# EAGLE design Mixer-Analog-LM3900-Rev-A (EAGLE 8.4.3)
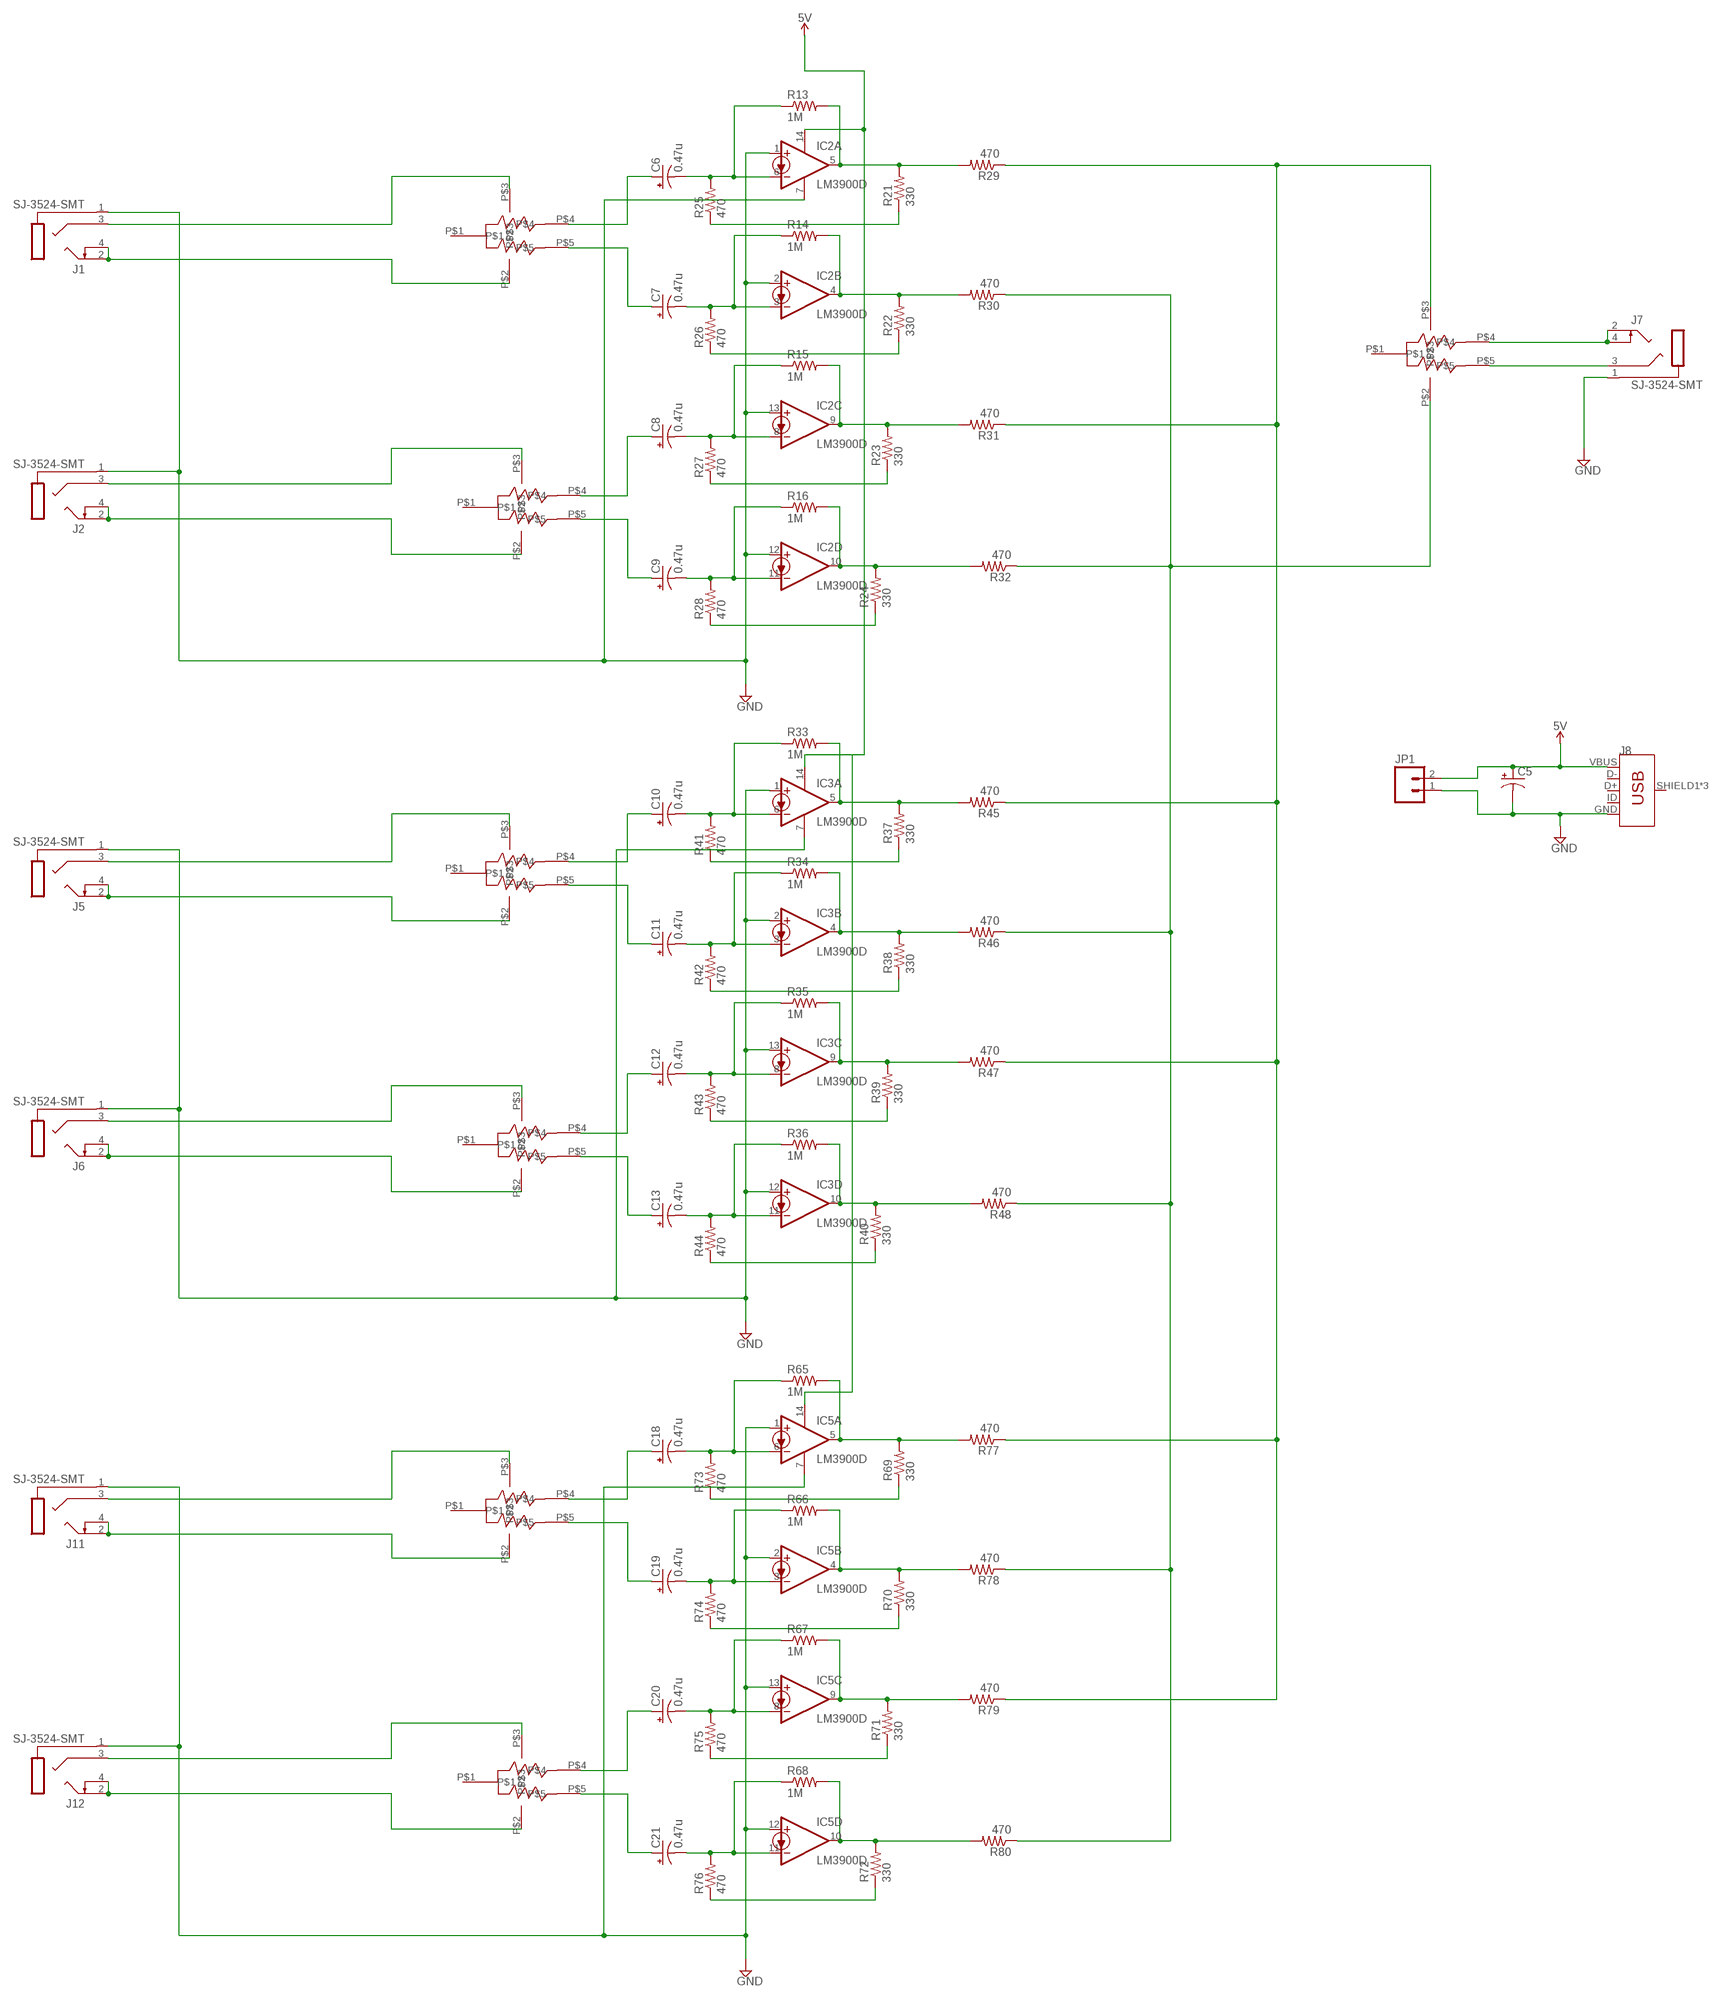
[diagram p0: schematic, sheet 1]

## Parts
C5  CAP_POLPTH1  [CPOL-RADIAL-100UF-25V]
C6  0.47u  CAP_POL1206-KIT  [EIA3216-KIT]
C7  0.47u  CAP_POL1206-KIT  [EIA3216-KIT]
C8  0.47u  CAP_POL1206-KIT  [EIA3216-KIT]
C9  0.47u  CAP_POL1206-KIT  [EIA3216-KIT]
C10  0.47u  CAP_POL1206-KIT  [EIA3216-KIT]
C11  0.47u  CAP_POL1206-KIT  [EIA3216-KIT]
C12  0.47u  CAP_POL1206-KIT  [EIA3216-KIT]
C13  0.47u  CAP_POL1206-KIT  [EIA3216-KIT]
C18  0.47u  CAP_POL1206-KIT  [EIA3216-KIT]
C19  0.47u  CAP_POL1206-KIT  [EIA3216-KIT]
C20  0.47u  CAP_POL1206-KIT  [EIA3216-KIT]
C21  0.47u  CAP_POL1206-KIT  [EIA3216-KIT]
IC2  LM3900D  [SO14]
IC3  LM3900D  [SO14]
IC5  LM3900D  [SO14]
J1  SJ-3524-SMT  [SJ-3524-SMT]
J2  SJ-3524-SMT  [SJ-3524-SMT]
J5  SJ-3524-SMT  [SJ-3524-SMT]
J6  SJ-3524-SMT  [SJ-3524-SMT]
J7  SJ-3524-SMT  [SJ-3524-SMT]
J8  USB_MICRO-B_FEMALE-SMT  [USB-B-MICRO-SMD]
J11  SJ-3524-SMT  [SJ-3524-SMT]
J12  SJ-3524-SMT  [SJ-3524-SMT]
JP1  M02LOCK  [1X02_LOCK]
R13  1M  RESISTOR1206  [1206]
R14  1M  RESISTOR1206  [1206]
R15  1M  RESISTOR1206  [1206]
R16  1M  RESISTOR1206  [1206]
R21  330  RESISTOR1206  [1206]
R22  330  RESISTOR1206  [1206]
R23  330  RESISTOR1206  [1206]
R24  330  RESISTOR1206  [1206]
R25  470  RESISTOR1206  [1206]
R26  470  RESISTOR1206  [1206]
R27  470  RESISTOR1206  [1206]
R28  470  RESISTOR1206  [1206]
R29  470  RESISTOR1206  [1206]
R30  470  RESISTOR1206  [1206]
R31  470  RESISTOR1206  [1206]
R32  470  RESISTOR1206  [1206]
R33  1M  RESISTOR1206  [1206]
R34  1M  RESISTOR1206  [1206]
R35  1M  RESISTOR1206  [1206]
R36  1M  RESISTOR1206  [1206]
R37  330  RESISTOR1206  [1206]
R38  330  RESISTOR1206  [1206]
R39  330  RESISTOR1206  [1206]
R40  330  RESISTOR1206  [1206]
R41  470  RESISTOR1206  [1206]
R42  470  RESISTOR1206  [1206]
R43  470  RESISTOR1206  [1206]
R44  470  RESISTOR1206  [1206]
R45  470  RESISTOR1206  [1206]
R46  470  RESISTOR1206  [1206]
R47  470  RESISTOR1206  [1206]
R48  470  RESISTOR1206  [1206]
R65  1M  RESISTOR1206  [1206]
R66  1M  RESISTOR1206  [1206]
R67  1M  RESISTOR1206  [1206]
R68  1M  RESISTOR1206  [1206]
R69  330  RESISTOR1206  [1206]
R70  330  RESISTOR1206  [1206]
R71  330  RESISTOR1206  [1206]
R72  330  RESISTOR1206  [1206]
R73  470  RESISTOR1206  [1206]
R74  470  RESISTOR1206  [1206]
R75  470  RESISTOR1206  [1206]
R76  470  RESISTOR1206  [1206]
R77  470  RESISTOR1206  [1206]
R78  470  RESISTOR1206  [1206]
R79  470  RESISTOR1206  [1206]
R80  470  RESISTOR1206  [1206]
U$3  POT-DUAL-ALPS-RK10J12E0A0A  [POT-DUAL-ALPS-RK10J12E0A0A]
U$4  POT-DUAL-ALPS-RK10J12E0A0A  [POT-DUAL-ALPS-RK10J12E0A0A]
U$5  POT-DUAL-ALPS-RK10J12E0A0A  [POT-DUAL-ALPS-RK10J12E0A0A]
U$6  POT-DUAL-ALPS-RK10J12E0A0A  [POT-DUAL-ALPS-RK10J12E0A0A]
U$7  POT-DUAL-ALPS-RK10J12E0A0A  [POT-DUAL-ALPS-RK10J12E0A0A]
U$10  POT-DUAL-ALPS-RK10J12E0A0A  [POT-DUAL-ALPS-RK10J12E0A0A]
U$11  POT-DUAL-ALPS-RK10J12E0A0A  [POT-DUAL-ALPS-RK10J12E0A0A]

## Nets
5V: C5.1(+) IC2.14(P:V+) IC3.14(P:V+) IC5.14(P:V+) J8.VBUS JP1.2
GND: C5.2(-) IC2.1(A:+IN) IC2.2(B:+IN) IC2.7(P:GND) IC2.12(D:+IN) IC2.13(C:+IN) IC3.1(A:+IN) IC3.2(B:+IN) IC3.7(P:GND) IC3.12(D:+IN) IC3.13(C:+IN) IC5.1(A:+IN) IC5.2(B:+IN) IC5.7(P:GND) IC5.12(D:+IN) IC5.13(C:+IN) J1.1(S) J2.1(S) J5.1(S) J6.1(S) J7.1(S) J8.GND J11.1(S) J12.1(S) JP1.1
N$18: IC2.5(A:OUT) R13.2 R21.2 R29.2
N$21: C6.C(-) IC2.6(A:-IN) R13.1 R25.2
N$23: R21.1 R25.1
N$24: IC2.4(B:OUT) R14.2 R22.2 R30.2
N$25: C7.C(-) IC2.3(B:-IN) R14.1 R26.2
N$26: R22.1 R26.1
N$27: IC2.9(C:OUT) R15.2 R23.2 R31.2
N$28: C8.C(-) IC2.8(C:-IN) R15.1 R27.2
N$29: R23.1 R27.1
N$30: IC2.10(D:OUT) R16.2 R24.2 R32.2
N$31: C9.C(-) IC2.11(D:-IN) R16.1 R28.2
N$32: R24.1 R28.1
N$33: C9.A(+) U$3.P$5
N$34: C8.A(+) U$3.P$4
N$35: C7.A(+) U$4.P$5
N$36: C6.A(+) U$4.P$4
N$37: J1.2(T) J1.4(TS) U$4.P$2
N$38: J2.2(T) J2.4(TS) U$3.P$2
N$39: J2.3(R) U$3.P$3
N$40: J1.3(R) U$4.P$3
N$43: IC3.5(A:OUT) R33.2 R37.2 R45.2
N$44: C10.C(-) IC3.6(A:-IN) R33.1 R41.2
N$45: R37.1 R41.1
N$46: IC3.4(B:OUT) R34.2 R38.2 R46.2
N$47: C11.C(-) IC3.3(B:-IN) R34.1 R42.2
N$48: R38.1 R42.1
N$49: IC3.9(C:OUT) R35.2 R39.2 R47.2
N$50: C12.C(-) IC3.8(C:-IN) R35.1 R43.2
N$51: R39.1 R43.1
N$52: IC3.10(D:OUT) R36.2 R40.2 R48.2
N$53: C13.C(-) IC3.11(D:-IN) R36.1 R44.2
N$54: R40.1 R44.1
N$55: C13.A(+) U$5.P$5
N$56: C12.A(+) U$5.P$4
N$57: C11.A(+) U$6.P$5
N$58: C10.A(+) U$6.P$4
N$59: J5.2(T) J5.4(TS) U$6.P$2
N$60: J6.2(T) J6.4(TS) U$5.P$2
N$61: J7.2(T) J7.4(TS) U$7.P$4
N$62: J7.3(R) U$7.P$5
N$64: J6.3(R) U$5.P$3
N$66: J5.3(R) U$6.P$3
N$91: IC5.5(A:OUT) R65.2 R69.2 R77.2
N$92: C18.C(-) IC5.6(A:-IN) R65.1 R73.2
N$93: R69.1 R73.1
N$94: IC5.4(B:OUT) R66.2 R70.2 R78.2
N$95: C19.C(-) IC5.3(B:-IN) R66.1 R74.2
N$96: R70.1 R74.1
N$97: IC5.9(C:OUT) R67.2 R71.2 R79.2
N$98: C20.C(-) IC5.8(C:-IN) R67.1 R75.2
N$99: R71.1 R75.1
N$100: IC5.10(D:OUT) R68.2 R72.2 R80.2
N$101: C21.C(-) IC5.11(D:-IN) R68.1 R76.2
N$102: R72.1 R76.1
N$103: C21.A(+) U$10.P$5
N$104: C20.A(+) U$10.P$4
N$105: C19.A(+) U$11.P$5
N$106: C18.A(+) U$11.P$4
N$107: J11.2(T) J11.4(TS) U$11.P$2
N$108: J12.2(T) J12.4(TS) U$10.P$2
N$109: J12.3(R) U$10.P$3
N$110: J11.3(R) U$11.P$3
N$111: R29.1 R31.1 R45.1 R47.1 R77.1 R79.1 U$7.P$3
N$112: R30.1 R32.1 R46.1 R48.1 R78.1 R80.1 U$7.P$2
Unconnected: J8.D+ J8.D- J8.ID J8.SHIELD1(SHIELD) J8.SHIELD2(SHIELD) J8.SHIELD3(SHIELD) U$3.P$1 U$4.P$1 U$5.P$1 U$6.P$1 U$7.P$1 U$10.P$1 U$11.P$1

## Library data of the parts
C5-C13 C18-C21 = SparkFun-Passives:CAP_POL: Capacitor Polarized These are standard SMD and PTH capacitors. Normally 10uF, 47uF, and 100uF in electrolytic and tantalum varieties. Always verify the external diameter of the through hole cap, it varies with capacity, voltage, and manufacturer. The EIA devices should be standard.
IC2 IC3 IC5 = linear:LM3900: OP AMP
J1 J2 J5-J7 J11 J12 = con-cuistack:SJ-3524: 3.5 Stereo audio jack (SMT)
J8 = SparkFun-Connectors:USB_MICRO-B: USB Type Micro-B Connector Male/female and PTH/SMT variants SparkFun Products: SparkFun microB USB Breakout <https://www.sparkfun.com/products/12035> SparkFun USB microB Plug Breakout <https://www.sparkfun.com/products/10031> SparkFun ESP8266 Thing <https://www.sparkfun.com/products/13231>; PROD_ID: CONN-11752
JP1 = CMU-ArtFab:M02: Header 2 Standard 2-pin 0.1" header. Use with straight break away headers (SKU : PRT-00116), right angle break away headers (PRT-00553), swiss pins (PRT-00743), machine pins (PRT-00117), and female headers (PRT-00115). Molex polarized connector foot print use with SKU : PRT-08233 with associated crimp pins and housings.
R13-R16 R21-R48 R65-R80 = SparkFun-Passives:RESISTOR: Resistor Basic schematic elements and footprints for 0603, 1206, and PTH resistors.
U$3-U$7 U$10 U$11 = CMU-ArtFab:POT-DUAL-ALPS-RK10J12E0A0A

## Board
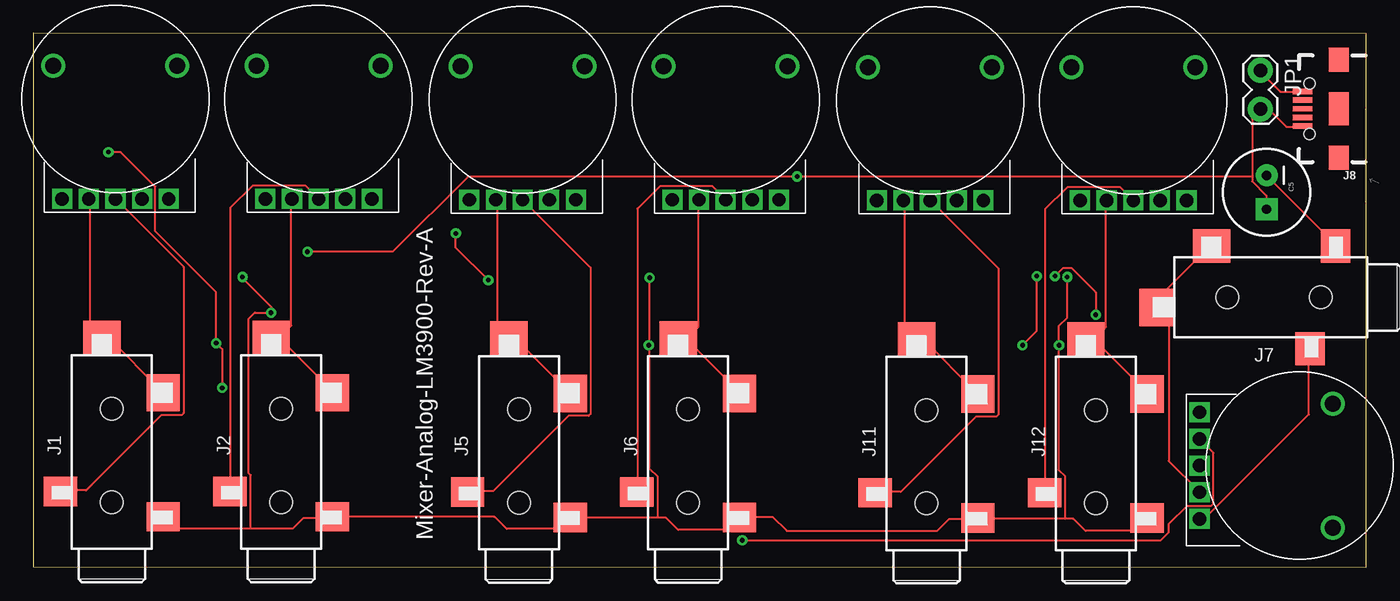
[diagram p1: board, top side]
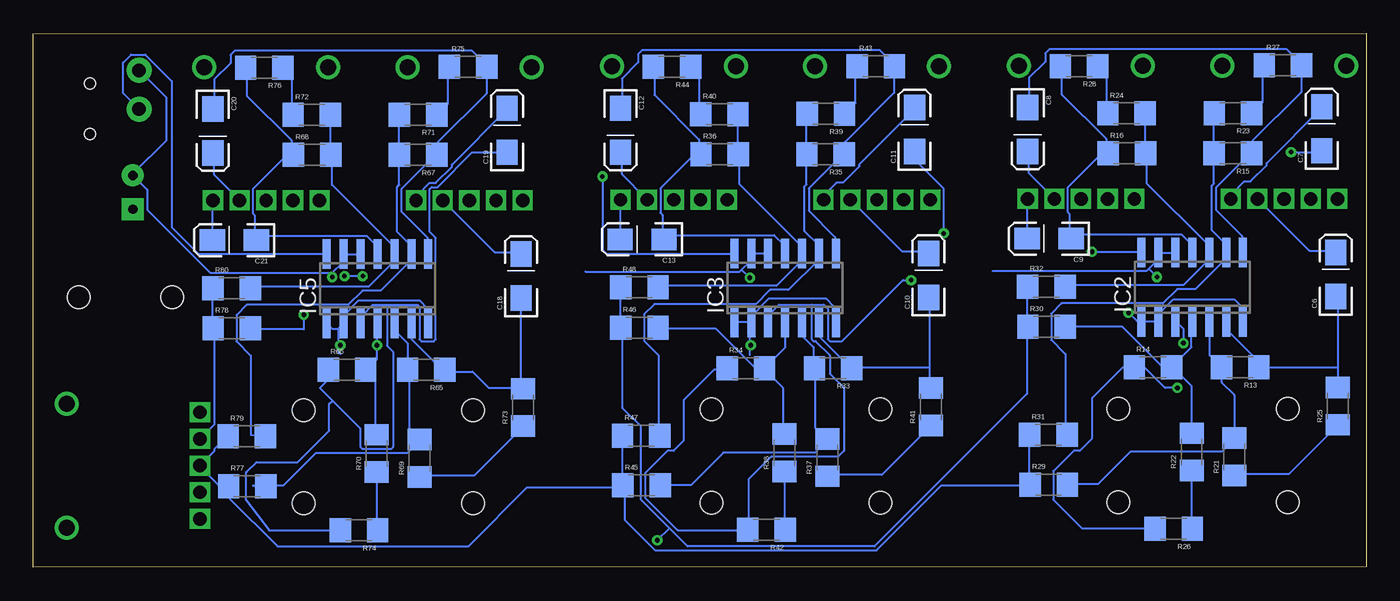
[diagram p2: board, bottom side, seen from below]

Size 100 x 40.05 mm. Coordinates in mm from the lower left corner, seen from the top.
Outline: 0,0.05 100,0 100,40 0,40.05 0,0.05
Copper layers (1*16): Top 0.035mm / dielectric 1.5mm / Bottom 0.035mm
Design rules "default": minimum track width 6mil, minimum drill 0.35mm, track to track 6mil, track to pad 6mil, pad to pad 6mil, via to via 6mil, smd to smd 6mil, copper to edge 40mil, drill to drill 6mil, minimum pad ring 10mil, minimum via ring 8mil, stop-mask expansion 4mil, vias tented up to drill 0mil, thermal gap 10mil

### Footprints (pad centres in the part's own frame; a part is rotated, then mirrored left to right if it is on the bottom)
CPOL-RADIAL-100UF-25V = drill 0.7 pad 1.651 square: 1 1.27,0 | drill 0.7 pad 1.651: 2 -1.27,0
EIA3216-KIT = smd 1.9 x 1.6: A 1.65,0; C -1.65,0
SO14 = smd 0.6 x 2.2: 1 -3.81,-2.6; 2 -2.54,-2.6; 3 -1.27,-2.6; 4 0,-2.6; 5 1.27,-2.6; 6 2.54,-2.6; 7 3.81,-2.6; 8 3.81,2.6; 9 2.54,2.6; 10 1.27,2.6; 11 0,2.6; 12 -1.27,2.6; 13 -2.54,2.6; 14 -3.81,2.6
SJ-3524-SMT = smd 2.5 x 2.2: 1 3.85,-4.6; 3 -3.85,-2.7 | smd 2.5 x 2.8: 2 3.85,4.7 | smd 2.8 x 2.5: 4 -0.75,8.85 | hole 1.7: 0,-3.5; 0,3.5
USB-B-MICRO-SMD = smd 1.45 x 0.4: D+ 2.725,0; D- 2.725,0.65; GND 2.725,-1.3; ID 2.725,-0.65; VBUS 2.725,1.3 | smd 1.5 x 1.8: SHIELD1 0,3.685; SHIELD2 0,-3.685 | smd 1.5 x 2.5: SHIELD3 0,0 | hole 0.85: 2.2,1.9; 2.2,-1.9
1X02_LOCK = drill 1.016 pad 1.88: 1 -0.178,0; 2 2.718,0
1206 = smd 1.6 x 1.8: 1 -1.4,0; 2 1.4,0
POT-DUAL-ALPS-RK10J12E0A0A = drill 1 pad 1.321 square: P$1 -4,0; P$2 -2,0; P$3 0,0; P$4 2,0; P$5 4,0 | drill 1.2: P$6 4.65,10; P$7 -4.65,10

### Placement (x,y rotation side)
C5  92.53,28.13 270 top
C6  2.28,21.96 90 bottom
C7  3.33,32.89 90 bottom
C8  25.4,32.84 270 bottom
C9  23.79,24.66 180 bottom
C10  32.83,21.9 90 bottom
C11  33.88,32.83 90 bottom
C12  55.95,32.78 270 bottom
C13  54.34,24.6 180 bottom
C18  63.41,21.85 90 bottom
C19  64.46,32.78 90 bottom
C20  86.53,32.73 270 bottom
C21  84.92,24.55 180 bottom
IC2  13.05,21.01 0 bottom
IC3  43.6,20.95 0 bottom
IC5  74.18,20.9 0 bottom
J1  5.89,8.4 0 top
J2  18.59,8.4 0 top
J5  36.44,8.34 0 top
J6  49.14,8.34 0 top
J7  93.09,20.25 90 top
J8  97.96,34.39 180 top
J11  67.02,8.29 0 top
J12  79.72,8.29 0 top
JP1  92.06,37.09 270 top
R13  9.45,15 180 bottom
R14  16,15 0 bottom
R15  10.01,31.04 180 bottom
R16  17.96,31.04 0 bottom
R21  9.89,8.29 90 bottom
R22  13.1,8.65 90 bottom
R23  10,34.07 180 bottom
R24  17.98,34.04 0 bottom
R25  2.12,12.1 90 bottom
R26  14.45,2.89 180 bottom
R27  6.25,37.64 0 bottom
R28  21.54,37.59 180 bottom
R29  23.82,6.2 0 bottom
R30  23.98,18.04 0 bottom
R31  23.85,9.94 0 bottom
R32  23.99,21.06 0 bottom
R33  40,14.94 180 bottom
R34  46.55,14.94 0 bottom
R35  40.56,30.98 180 bottom
R36  48.51,30.98 0 bottom
R37  40.43,8.23 90 bottom
R38  43.65,8.59 90 bottom
R39  40.55,34.01 180 bottom
R40  48.53,33.98 0 bottom
R41  32.67,12.04 90 bottom
R42  44.99,2.83 180 bottom
R43  36.8,37.58 0 bottom
R44  52.09,37.53 180 bottom
R45  54.37,6.14 0 bottom
R46  54.53,17.98 0 bottom
R47  54.4,9.87 0 bottom
R48  54.54,21 0 bottom
R65  70.52,14.81 180 bottom
R66  76.47,14.83 0 bottom
R67  71.14,30.93 180 bottom
R68  79.09,30.93 0 bottom
R69  71.01,8.18 90 bottom
R70  74.23,8.54 90 bottom
R71  71.13,33.96 180 bottom
R72  79.11,33.93 0 bottom
R73  63.25,11.99 90 bottom
R74  75.57,2.78 180 bottom
R75  67.38,37.53 0 bottom
R76  82.67,37.48 180 bottom
R77  83.95,6.09 0 bottom
R78  85.11,17.93 0 bottom
R79  83.98,9.82 0 bottom
R80  85.12,20.95 0 bottom
U$3  21.4,27.63 0 top
U$4  6.16,27.63 0 top
U$5  51.95,27.57 0 top
U$6  36.71,27.57 0 top
U$7  87.5,7.63 270 top
U$10  82.53,27.52 0 top
U$11  67.29,27.52 0 top

### Tracks (layer width: path | path; a pad name or v marks a point on that pad's centre or on a via)
5V  (via drill 0.35)
  Top 0.152: 91.44,29.31 91.44,33.66 92.05,34.27 JP1.2 92.68,34.37 94,33.05 95.19,33.05 J8.VBUS | 91.44,29.31 91.44,28.94 92.51,27.87 92.51,26.96 C5.1 | v20.57,23.67 26.98,23.67 32.61,29.31 v57.3,29.31 91.44,29.31
  Bottom 0.152: v20.57,23.67 16.92,23.67 IC2.14 | v57.3,29.31 57.3,23.82 57,23.52 47.55,23.52 IC3.14 | IC5.14 78.03,23.52 87.63,23.52 89.61,25.5 89.61,36.47 91.59,38.45 92.66,38.45 93.27,37.84 93.27,35.56 92.2,34.49 JP1.2
GND  (via drill 0.35)
  Top 0.152: 46.85,3.73 47.46,3.73 48.38,2.82 52.03,2.82 52.95,3.73 J6.1 53.03,3.79 55.47,3.79 56.54,2.73 67.82,2.73 68.73,3.64 70.71,3.64 J11.1 70.87,3.64 77.42,3.64 | 46.85,3.73 J5.1 40.23,3.64 39.47,2.88 35.51,2.88 34.59,3.79 22.55,3.79 J2.1 22.4,3.71 20.27,3.71 19.51,2.95 16.31,2.95 | 46.24,16.66 46.24,7.39 46.85,6.78 46.85,3.73 | 46.24,16.66 v46.24,21.71 | J7.1 97.69,24.21 92.51,29.4 C5.2 | 77.42,3.64 78.03,3.64 78.94,2.73 82.6,2.73 83.52,3.64 J12.1 | 77.42,3.64 77.42,6.84 76.96,7.3 v76.96,16.66 76.96,18.12 77.57,18.73 v77.57,21.78 | v15.7,21.78 15.7,21.69 17.83,19.56 v17.83,19.1 16.61,19.1 16.15,18.64 16.15,7.06 16.31,6.91 16.31,2.95 | 16.31,2.95 10.52,2.95 9.75,3.71 J1.1 | v46.18,16.66 46.24,16.66 | JP1.1 92.06,37.18 93.56,35.68 J8.GND
  Bottom 0.152: IC2.7 9.3,18.42 9.3,19.49 9.91,20.1 14.48,20.1 15.54,19.03 15.54,18.42 IC2.2 15.7,18.42 16.76,18.42 IC2.1 16.92,18.49 17.22,18.49 v17.83,19.1 | IC2.12 15.54,23.61 IC2.13 15.7,23.61 15.7,23 16.31,22.39 | 16.31,22.39 16.46,22.23 28.04,22.23 | 16.31,22.39 v15.7,21.78 | IC3.1 47.31,18.36 46.24,18.36 IC3.2 | 46.24,15.92 46.24,16.66 | 46.24,16.66 46.24,18.21 IC3.2 | IC3.12 46.09,23.54 IC3.13 46.24,23.54 46.24,22.94 46.85,22.32 | 46.85,22.32 47.01,22.17 58.59,22.17 | 46.85,22.32 v46.24,21.71 | 77.89,18.31 IC5.1 77.88,18.19 77.57,17.88 77.11,17.88 | 76.82,18.31 IC5.2 | IC5.12 76.67,23.49 IC5.13 76.81,23.45 76.81,22.84 77.57,22.08 | 77.57,22.08 86.72,22.08 91.44,26.81 91.44,28.33 92.51,29.4 C5.2 92.53,29.52 90,32.05 90,35.21 JP1.1 | 76.96,15.99 77.11,16.14 77.11,16.66 | v77.57,21.78 77.57,22.08 | IC3.7 39.93,18.49 39.93,19.56 40.54,20.17 44.81,20.17 46.02,18.95 46.02,18.49 IC3.2 | IC5.7 70.41,18.34 70.41,19.41 71.02,20.01 75.59,20.01 76.66,18.95 76.66,18.34 IC5.2 | 77.11,17.88 77.11,16.66 | 77.11,17.88 76.81,18.19 IC5.2 | v76.96,16.66 77.11,16.66 | v46.18,16.66 46.24,16.66
N$18
  Bottom 0.152: R29.2 22.4,6.23 20.12,6.23 17.68,8.67 10.82,8.67 9.91,9.58 R21.2 9.91,9.74 9.91,12.94 10.82,13.85 R13.2 10.97,15.14 11.73,15.9 11.73,18.34 IC2.5
N$21
  Bottom 0.152: IC2.6 10.36,18.34 10.36,17.73 8.08,15.44 8.08,15.14 R13.1 7.92,14.99 2.13,14.99 | 2.13,14.99 2.13,20.17 C6.C | 2.13,14.99 2.13,13.61 R25.2
N$23
  Bottom 0.152: R21.1 9.75,6.99 5.79,6.99 2.13,10.65 R25.1
N$24
  Bottom 0.152: R22.2 13.11,10.11 13.11,13.61 14.48,14.99 R14.2 | R30.2 22.55,18.03 18.29,18.03 15.39,15.14 14.63,15.14 R14.2 | IC2.4 13.11,18.34 13.11,16.51 14.48,15.14 R14.2
N$25  (via drill 0.35)
  Top 0.152: v5.64,31.14 6.55,31.14 9.14,28.55 9.14,25.2 13.72,20.62 v13.72,16.81 14.17,16.36 v14.17,13.46
  Bottom 0.152: R26.2 15.85,2.95 21.34,2.95 23.47,5.08 23.47,7.21 21.95,8.74 21.49,8.74 20.57,9.65 20.57,12.7 18.29,14.99 17.53,14.99 R14.1 17.37,14.99 16.61,14.99 15.09,13.46 v14.17,13.46 | v5.64,31.14 3.35,31.14 C7.C | v13.72,16.81 13.72,17.88 14.17,18.34 IC2.3
N$26
  Bottom 0.152: R26.1 13.11,3.03 13.11,7.15 R22.1
N$27
  Bottom 0.152: R23.2 11.43,33.97 11.43,31.07 R15.2 11.43,30.92 11.43,28.79 11.58,28.63 11.58,25.28 10.52,24.21 10.52,23.76 IC2.9 10.52,23.15 12.8,20.86 14.17,20.86 15.24,19.8 22.86,19.8 23.62,19.03 23.62,17.05 22.55,15.99 22.55,10.04 R31.2
N$28
  Bottom 0.152: C8.C 25.3,34.58 25.3,36.71 24.08,37.93 24.08,38.54 23.77,38.84 5.94,38.84 4.88,37.78 R27.2 4.88,37.63 4.88,35.64 8.53,31.99 8.53,31.07 R15.1 8.69,31.07 11.28,28.48 11.28,26.81 9.3,24.82 9.3,23.76 IC2.8
N$29
  Bottom 0.152: R27.1 7.77,37.63 7.77,34.88 8.53,34.12 R23.1
N$30
  Bottom 0.152: R24.2 16.61,33.97 16.61,31.07 R16.2 16.46,30.92 16.46,28.79 11.89,24.21 11.89,23.76 IC2.10 11.89,23.61 11.89,23 13.72,21.17 22.55,21.17 R32.2
N$31
  Bottom 0.152: R28.2 22.86,37.47 22.86,35.49 19.51,32.14 19.51,31.07 R16.1 19.51,30.92 19.96,30.92 22.4,28.48 22.4,26.65 22.25,26.5 22.25,24.98 | 22.25,24.98 22.25,24.67 C9.C 22.25,24.98 | 22.25,24.98 13.87,24.98 13.11,24.21 13.11,23.76 IC2.11
N$32
  Bottom 0.152: R24.1 19.51,34.12 19.51,36.86 20.12,37.47 R28.1
N$33
  Bottom 0.152: C9.A 25.45,24.67 25.45,27.57 U$3.P$5
N$34
  Bottom 0.152: C8.A 25.3,31.07 25.3,29.55 23.47,27.72 U$3.P$4
N$35
  Bottom 0.152: C7.A 3.35,34.43 7.47,30.31 7.47,30.16 8.69,28.94 9.14,28.94 10.06,28.03 10.06,27.72 U$4.P$5
N$36
  Bottom 0.152: C6.A 2.29,23.76 4.27,23.76 8.08,27.57 U$4.P$4
N$37
  Top 0.152: J1.2 9.6,13.24 5.64,17.2 5.18,17.2 J1.4 5.03,17.36 4.27,18.12 4.27,27.57 U$4.P$2
N$38
  Top 0.152: 18.44,17.2 17.98,17.2 J2.4 18.44,17.2 | 18.44,17.2 22.4,13.24 J2.2 | 18.44,17.2 19.36,18.12 19.36,27.57 U$3.P$2
N$39
  Top 0.152: J2.3 14.78,5.77 14.78,26.96 16.46,28.63 20.42,28.63 21.34,27.72 U$3.P$3
N$40
  Top 0.152: J1.3 2.13,5.77 3.96,5.77 9.6,11.41 11.12,11.41 11.28,11.57 11.28,22.54 6.25,27.57 U$4.P$3
N$43
  Bottom 0.152: R45.2 52.95,6.17 50.66,6.17 48.22,8.61 41.37,8.61 40.45,9.52 R37.2 40.54,9.65 41.3,10.41 41.3,14.83 R33.2 41.45,14.99 41.45,16.51 42.22,17.27 42.22,18.34 IC3.5
N$44
  Bottom 0.152: IC3.6 41,18.34 41,17.27 38.71,14.99 R33.1 38.56,14.99 32.77,14.99 | 32.77,14.99 32.77,20.17 C10.C | 32.77,14.99 32.77,13.46 R41.2
N$45
  Bottom 0.152: R37.1 40.3,6.93 36.34,6.93 32.68,10.59 R41.1
N$46
  Bottom 0.152: 43.65,17.6 43.65,18.21 IC3.4 43.59,17.58 43.59,16.51 45.11,14.99 R34.2 | R38.2 43.74,10.11 43.74,13.46 45.11,14.83 R34.2 | R46.2 53.03,17.88 48.77,17.88 45.87,14.99 45.26,14.99 R34.2
N$47  (via drill 0.35)
  Top 0.152: v31.7,25.04 31.7,23.98 v34.14,21.54
  Bottom 0.152: R34.1 48.01,14.83 48.92,14.83 51.21,12.55 51.21,9.5 51.97,8.74 52.43,8.74 54.1,7.06 54.1,5.23 51.66,2.79 46.48,2.79 R42.2 46.33,2.95 46.33,6.6 44.65,8.28 39.62,8.28 39.17,8.74 39.17,13.46 40.23,14.53 40.23,15.9 41.3,16.97 41.45,16.97 41.6,17.12 41.6,19.71 | v31.7,25.04 31.7,28.4 33.83,30.53 33.83,31.14 C11.C | v34.14,21.54 34.75,21.54 39.32,16.97 40.23,16.97 40.39,17.12 40.39,19.41 40.69,19.71 41.6,19.71 | 41.6,19.71 44.04,19.71 44.81,18.95 44.81,18.49 IC3.3
N$48
  Bottom 0.152: R42.1 43.65,2.97 43.65,7.08 R38.1
N$49
  Bottom 0.152: R39.2 41.98,33.91 41.98,31.01 R35.2 41.98,30.86 41.98,28.73 42.13,28.57 42.13,25.22 41.06,24.15 41.06,23.7 IC3.9 41.06,23.09 43.35,20.8 44.72,20.8 45.79,19.73 53.41,19.73 54.17,18.97 54.17,16.99 53.1,15.92 53.1,9.98 R47.2
N$50
  Bottom 0.152: C12.C 55.84,34.52 55.84,36.65 54.62,37.87 54.62,38.48 54.32,38.78 36.49,38.78 35.42,37.72 R43.2 35.42,37.56 35.42,35.58 39.08,31.93 39.08,31.01 R35.1 39.23,31.01 41.82,28.42 41.82,26.75 39.84,24.76 39.84,23.7 IC3.8
N$51
  Bottom 0.152: R43.1 38.32,37.56 38.32,34.82 39.08,34.06 R39.1
N$52
  Bottom 0.152: R40.2 47.16,33.91 47.16,31.01 R36.2 47.01,30.86 47.01,28.73 42.43,24.15 42.43,23.7 IC3.10 42.43,23.54 42.43,22.94 44.26,21.11 53.1,21.11 R48.2
N$53
  Bottom 0.152: R44.2 53.41,37.41 53.41,35.43 50.05,32.08 50.05,31.01 R36.1 50.05,30.86 50.51,30.86 52.95,28.42 52.95,26.59 52.8,26.44 52.8,24.92 | 52.8,24.92 52.8,24.61 C13.C 52.8,24.92 | 52.8,24.92 44.41,24.92 43.65,24.15 43.65,23.7 IC3.11
N$54
  Bottom 0.152: R40.1 50.05,34.06 50.05,36.8 50.66,37.41 R44.1
N$55
  Bottom 0.152: C13.A 56,27.51 U$5.P$5
N$56
  Bottom 0.152: C12.A 55.84,31.01 55.84,29.49 54.02,27.66 U$5.P$4
N$57
  Bottom 0.152: C11.A 33.9,34.36 38.01,30.25 38.01,30.1 39.23,28.88 39.69,28.88 40.6,27.96 40.6,27.66 U$6.P$5
N$58
  Bottom 0.152: C10.A 32.83,23.7 34.81,23.7 38.62,27.51 U$6.P$4
N$59
  Top 0.152: J5.2 40.15,13.18 36.18,17.14 35.73,17.14 J5.4 35.58,17.3 34.81,18.06 34.81,27.51 U$6.P$2
N$60
  Top 0.152: 48.99,17.14 48.53,17.14 J6.4 48.99,17.14 | 48.99,17.14 52.95,13.18 J6.2 | 48.99,17.14 49.9,18.06 49.9,27.51 U$5.P$2
N$61
  Top 0.152: J7.2 88.24,24.06 84.28,20.1 84.28,19.64 J7.4 84.28,19.41 85.19,18.49 85.19,7.97 87.48,5.69 U$7.P$4
N$62
  Top 0.152: J7.3 95.71,16.36 95.71,11.48 87.94,3.71 87.63,3.71 U$7.P$5
N$64
  Top 0.152: J6.3 45.33,5.71 45.33,26.9 47.01,28.57 50.97,28.57 51.88,27.66 U$5.P$3
N$66
  Top 0.152: J5.3 32.68,5.71 34.51,5.71 40.15,11.35 41.67,11.35 41.82,11.51 41.82,22.48 36.79,27.51 U$6.P$3
N$91
  Bottom 0.152: R77.2 83.53,6.12 81.24,6.12 78.8,8.56 71.95,8.56 71.03,9.47 R69.2 71.02,9.65 71.78,10.41 71.78,14.68 R65.2 71.93,14.83 71.93,16.81 72.85,17.73 72.85,18.19 IC5.5
N$92
  Bottom 0.152: 63.4,13.46 65.84,13.46 67.06,14.68 69.04,14.68 R65.1 69.19,14.68 71.63,17.12 71.63,18.19 IC5.6 | 63.4,13.46 63.25,13.46 R73.2 63.4,13.46 | 63.4,13.46 63.4,20.17 C18.C
N$93
  Bottom 0.152: R69.1 70.88,6.88 66.92,6.88 63.26,10.54 R73.1
N$94  (via drill 0.35)
  Top 0.152: v79.7,18.95 79.7,20.62 77.88,22.45 77.27,22.45 v76.66,21.84 | v75.29,21.84 75.29,17.73 v74.22,16.66
  Bottom 0.152: R78.2 83.68,17.86 79.72,17.86 79.7,17.88 v79.7,18.95 | 74.23,17.55 74.23,18.16 IC5.4 74.22,17.58 v74.22,16.66 74.22,15.6 74.98,14.83 R66.2 74.98,14.68 74.37,14.07 74.37,9.96 R70.2 | v75.29,21.84 v76.66,21.84
N$95
  Bottom 0.152: R74.2 76.97,2.77 82.31,2.77 84.02,5.02 84.02,7.16 83.98,7.16 83.25,7.89 80.15,7.89 77.79,10.25 77.79,12.26 77.56,12.49 | 73.47,19.68 74.54,19.68 75.3,18.92 75.3,18.31 IC5.3 | 73.47,19.68 71.18,19.68 71.03,19.53 71.03,17.09 70.88,16.94 69.97,16.94 69.81,17.09 69.81,24.71 70.27,25.17 70.27,28.37 70.12,28.52 69.66,28.52 67.07,31.11 64.48,31.11 C19.C | 77.56,12.49 78.5,13.44 78.49,13.46 77.88,14.07 77.88,14.68 R66.1 | 77.56,12.49 75.45,10.39 75.45,9.02 75.3,8.86 73.17,8.86 73.01,9.02 73.01,16.18 73.47,16.64 73.47,19.68
N$96
  Bottom 0.152: R74.1 74.23,2.92 74.23,7.04 R70.1
N$97
  Bottom 0.152: R71.2 72.56,33.86 72.56,30.96 R67.2 72.56,30.81 72.56,28.68 72.71,28.52 72.71,25.17 71.64,24.1 71.64,23.65 IC5.9 71.64,23.04 73.93,20.75 75.3,20.75 76.37,19.68 83.99,19.68 84.75,18.92 84.75,16.94 83.68,15.87 83.68,9.93 R79.2
N$98
  Bottom 0.152: C20.C 86.42,34.47 86.42,36.6 85.2,37.82 85.2,38.43 84.9,38.73 67.07,38.73 66,37.67 R75.2 66,37.52 66,35.53 69.66,31.88 69.66,30.96 R67.1 69.81,30.96 72.4,28.37 72.4,26.7 70.42,24.71 70.42,23.65 IC5.8
N$99
  Bottom 0.152: R75.1 68.9,37.52 68.9,34.77 69.66,34.01 R71.1
N$100
  Bottom 0.152: R72.2 77.74,33.86 77.74,30.96 R68.2 77.58,30.81 77.58,28.68 73.01,24.1 73.01,23.65 IC5.10 73.01,23.49 73.01,22.89 74.84,21.06 83.68,21.06 R80.2
N$101
  Bottom 0.152: R76.2 83.99,37.36 83.99,35.38 80.63,32.03 80.63,30.96 R68.1 80.63,30.81 81.09,30.81 83.53,28.37 83.53,26.54 83.38,26.39 83.38,24.87 | 83.38,24.87 83.38,24.56 C21.C 83.38,24.87 | 83.38,24.87 74.99,24.87 74.23,24.1 74.23,23.65 IC5.11
N$102
  Bottom 0.152: R72.1 80.63,34.01 80.63,36.75 81.24,37.36 R76.1
N$103
  Bottom 0.152: C21.A 86.58,27.46 U$10.P$5
N$104
  Bottom 0.152: C20.A 86.42,30.96 86.42,29.44 84.59,27.61 U$10.P$4
N$105
  Bottom 0.152: C19.A 64.48,34.31 68.59,30.2 68.59,30.05 69.81,28.83 70.27,28.83 71.18,27.91 71.18,27.61 U$11.P$5
N$106
  Bottom 0.152: C18.A 63.41,23.65 65.39,23.65 69.2,27.46 U$11.P$4
N$107
  Top 0.152: J11.2 70.73,13.13 66.76,17.09 66.31,17.09 J11.4 66.16,17.25 65.39,18.01 65.39,27.46 U$11.P$2
N$108
  Top 0.152: 79.57,17.09 79.11,17.09 J12.4 79.57,17.09 | 79.57,17.09 83.53,13.13 J12.2 | 79.57,17.09 80.48,18.01 80.48,27.46 U$10.P$2
N$109
  Top 0.152: J12.3 75.91,5.66 75.91,26.85 77.58,28.52 81.55,28.52 82.46,27.61 U$10.P$3
N$110
  Top 0.152: J11.3 63.26,5.66 65.09,5.66 70.73,11.3 72.25,11.3 72.4,11.46 72.4,22.43 67.37,27.46 U$11.P$3
N$111
  Bottom 0.152: R31.1 25.3,9.89 25.3,6.23 R29.1 25.3,6.15 31.85,6.15 36.73,1.27 53.34,1.27 55.63,3.55 55.63,5.99 R45.1 | R45.1 55.84,6.17 55.84,9.83 R47.1 | R79.1 85.5,9.8 86.41,8.89 86.41,8.74 87.48,7.67 U$7.P$3 87.48,7.52 86.11,6.15 85.5,6.15 R77.1 85.34,5.99 85.34,5.23 81.69,1.57 67.36,1.57 62.94,5.99 55.78,5.99 R45.1
N$112  (via drill 0.35)
  Top 0.152: v53.19,2.03 84.58,2.03 85.19,2.64 85.19,3.25 86.56,4.62 88.39,4.62 88.54,4.77 88.54,8.58 87.63,9.5 U$7.P$2
  Bottom 0.152: R78.1 86.58,18.01 86.58,20.9 R80.1 | 86.58,17.86 R78.1 | R46.1 56,18.06 56,20.95 R48.1 | 56,17.91 R46.1 | R30.1 25.45,18.12 25.45,21.01 R32.1 | 25.45,17.97 R30.1 | R78.1 86.41,17.88 86.41,10.72 87.48,9.65 U$7.P$2 | 52.27,2.95 50.9,1.57 36.88,1.57 25.45,13 25.45,18.03 R30.1 | 52.27,2.95 54.41,5.08 54.41,10.57 55.78,11.94 55.78,17.88 R46.1 | 52.27,2.95 v53.19,2.03

### Text on the board
tNames: Mixer-Analog-LM3900-Rev-A